# EAGLE design lautnerv (EAGLE 6.2)

## Sheet 1 of 2
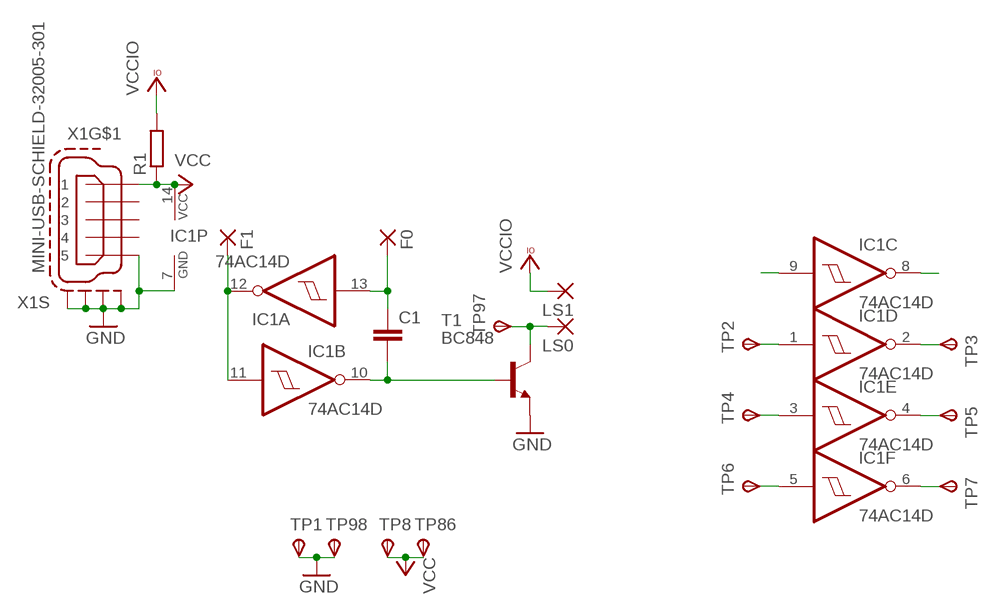
[diagram p0: schematic, sheet 1]

### Parts
C1  C-EUC1206K  [C1206K]
F0  SMD5  [SMD2,54-5,08]
F1  SMD5  [SMD2,54-5,08]
IC1  74AC14D  [SO14]
LS0  SMD5  [SMD2,54-5,08]
LS1  SMD5  [SMD2,54-5,08]
R1  R-EU_M1206  [M1206]
T1  BC848  BC848ASMD  [SOT23]
TP1  TPSTP12SQ  [TP12SQ]
TP2  TPSTP12SQ  [TP12SQ]
TP3  TPSTP12SQ  [TP12SQ]
TP4  TPSTP12SQ  [TP12SQ]
TP5  TPSTP12SQ  [TP12SQ]
TP6  TPSTP12SQ  [TP12SQ]
TP7  TPSTP12SQ  [TP12SQ]
TP8  TPSTP12SQ  [TP12SQ]
TP86  TPSTP12SQ  [TP12SQ]
TP97  TPSTP12SQ  [TP12SQ]
TP98  TPSTP12SQ  [TP12SQ]
X1  MINI-USB-SCHIELD-32005-301  [32005-301]

### Nets
F0: F1.1(P) IC1.11(B:I) IC1.12(A:O)
F1: C1.1 F0.1(P) IC1.13(A:I)
GND: IC1.7(P:GND) T1.2(E) TP1.TP(PP) TP98.TP(PP) X1.5 X1.M1(S:S1) X1.M2(S:S2) X1.M3(S:S3) X1.M4(S:S4)
N$1: LS0.1(P) T1.3(C) TP97.TP(PP)
N$3: IC1.8(C:O)
N$4: C1.2 IC1.10(B:O) T1.1(B)
N$5: IC1.2(D:O) TP3.TP(PP)
N$6: IC1.4(E:O) TP5.TP(PP)
N$7: IC1.6(F:O) TP7.TP(PP)
N$9: IC1.9(C:I)
N$10: IC1.1(D:I) TP2.TP(PP)
N$11: IC1.3(E:I) TP4.TP(PP)
N$12: IC1.5(F:I) TP6.TP(PP)
VCC: IC1.14(P:VCC) R1.1 TP8.TP(PP) TP86.TP(PP) X1.1
VCCIO: LS1.1(P) R1.2
Unconnected: X1.2 X1.3 X1.4

## Sheet 2 of 2
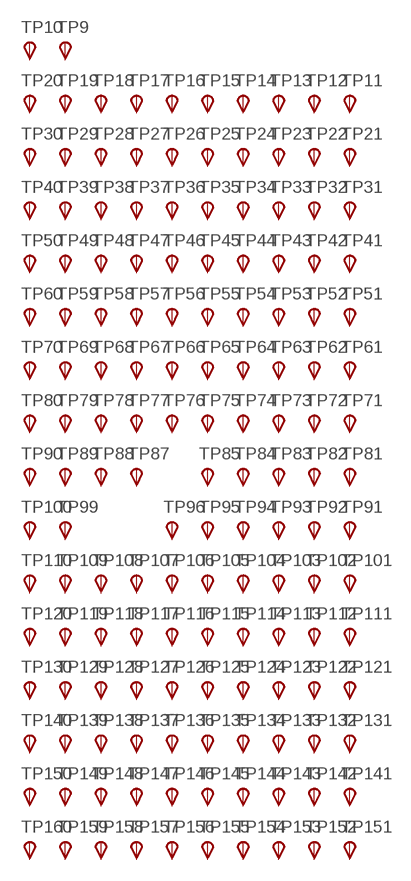
[diagram p1: schematic, sheet 2]

### Parts
TP9  TPSTP12SQ  [TP12SQ]
TP10  TPSTP12SQ  [TP12SQ]
TP11  TPSTP12SQ  [TP12SQ]
TP12  TPSTP12SQ  [TP12SQ]
TP13  TPSTP12SQ  [TP12SQ]
TP14  TPSTP12SQ  [TP12SQ]
TP15  TPSTP12SQ  [TP12SQ]
TP16  TPSTP12SQ  [TP12SQ]
TP17  TPSTP12SQ  [TP12SQ]
TP18  TPSTP12SQ  [TP12SQ]
TP19  TPSTP12SQ  [TP12SQ]
TP20  TPSTP12SQ  [TP12SQ]
TP21  TPSTP12SQ  [TP12SQ]
TP22  TPSTP12SQ  [TP12SQ]
TP23  TPSTP12SQ  [TP12SQ]
TP24  TPSTP12SQ  [TP12SQ]
TP25  TPSTP12SQ  [TP12SQ]
TP26  TPSTP12SQ  [TP12SQ]
TP27  TPSTP12SQ  [TP12SQ]
TP28  TPSTP12SQ  [TP12SQ]
TP29  TPSTP12SQ  [TP12SQ]
TP30  TPSTP12SQ  [TP12SQ]
TP31  TPSTP12SQ  [TP12SQ]
TP32  TPSTP12SQ  [TP12SQ]
TP33  TPSTP12SQ  [TP12SQ]
TP34  TPSTP12SQ  [TP12SQ]
TP35  TPSTP12SQ  [TP12SQ]
TP36  TPSTP12SQ  [TP12SQ]
TP37  TPSTP12SQ  [TP12SQ]
TP38  TPSTP12SQ  [TP12SQ]
TP39  TPSTP12SQ  [TP12SQ]
TP40  TPSTP12SQ  [TP12SQ]
TP41  TPSTP12SQ  [TP12SQ]
TP42  TPSTP12SQ  [TP12SQ]
TP43  TPSTP12SQ  [TP12SQ]
TP44  TPSTP12SQ  [TP12SQ]
TP45  TPSTP12SQ  [TP12SQ]
TP46  TPSTP12SQ  [TP12SQ]
TP47  TPSTP12SQ  [TP12SQ]
TP48  TPSTP12SQ  [TP12SQ]
TP49  TPSTP12SQ  [TP12SQ]
TP50  TPSTP12SQ  [TP12SQ]
TP51  TPSTP12SQ  [TP12SQ]
TP52  TPSTP12SQ  [TP12SQ]
TP53  TPSTP12SQ  [TP12SQ]
TP54  TPSTP12SQ  [TP12SQ]
TP55  TPSTP12SQ  [TP12SQ]
TP56  TPSTP12SQ  [TP12SQ]
TP57  TPSTP12SQ  [TP12SQ]
TP58  TPSTP12SQ  [TP12SQ]
TP59  TPSTP12SQ  [TP12SQ]
TP60  TPSTP12SQ  [TP12SQ]
TP61  TPSTP12SQ  [TP12SQ]
TP62  TPSTP12SQ  [TP12SQ]
TP63  TPSTP12SQ  [TP12SQ]
TP64  TPSTP12SQ  [TP12SQ]
TP65  TPSTP12SQ  [TP12SQ]
TP66  TPSTP12SQ  [TP12SQ]
TP67  TPSTP12SQ  [TP12SQ]
TP68  TPSTP12SQ  [TP12SQ]
TP69  TPSTP12SQ  [TP12SQ]
TP70  TPSTP12SQ  [TP12SQ]
TP71  TPSTP12SQ  [TP12SQ]
TP72  TPSTP12SQ  [TP12SQ]
TP73  TPSTP12SQ  [TP12SQ]
TP74  TPSTP12SQ  [TP12SQ]
TP75  TPSTP12SQ  [TP12SQ]
TP76  TPSTP12SQ  [TP12SQ]
TP77  TPSTP12SQ  [TP12SQ]
TP78  TPSTP12SQ  [TP12SQ]
TP79  TPSTP12SQ  [TP12SQ]
TP80  TPSTP12SQ  [TP12SQ]
TP81  TPSTP12SQ  [TP12SQ]
TP82  TPSTP12SQ  [TP12SQ]
TP83  TPSTP12SQ  [TP12SQ]
TP84  TPSTP12SQ  [TP12SQ]
TP85  TPSTP12SQ  [TP12SQ]
TP87  TPSTP12SQ  [TP12SQ]
TP88  TPSTP12SQ  [TP12SQ]
TP89  TPSTP12SQ  [TP12SQ]
TP90  TPSTP12SQ  [TP12SQ]
TP91  TPSTP12SQ  [TP12SQ]
TP92  TPSTP12SQ  [TP12SQ]
TP93  TPSTP12SQ  [TP12SQ]
TP94  TPSTP12SQ  [TP12SQ]
TP95  TPSTP12SQ  [TP12SQ]
TP96  TPSTP12SQ  [TP12SQ]
TP99  TPSTP12SQ  [TP12SQ]
TP100  TPSTP12SQ  [TP12SQ]
TP101  TPSTP12SQ  [TP12SQ]
TP102  TPSTP12SQ  [TP12SQ]
TP103  TPSTP12SQ  [TP12SQ]
TP104  TPSTP12SQ  [TP12SQ]
TP105  TPSTP12SQ  [TP12SQ]
TP106  TPSTP12SQ  [TP12SQ]
TP107  TPSTP12SQ  [TP12SQ]
TP108  TPSTP12SQ  [TP12SQ]
TP109  TPSTP12SQ  [TP12SQ]
TP110  TPSTP12SQ  [TP12SQ]
TP111  TPSTP12SQ  [TP12SQ]
TP112  TPSTP12SQ  [TP12SQ]
TP113  TPSTP12SQ  [TP12SQ]
TP114  TPSTP12SQ  [TP12SQ]
TP115  TPSTP12SQ  [TP12SQ]
TP116  TPSTP12SQ  [TP12SQ]
TP117  TPSTP12SQ  [TP12SQ]
TP118  TPSTP12SQ  [TP12SQ]
TP119  TPSTP12SQ  [TP12SQ]
TP120  TPSTP12SQ  [TP12SQ]
TP121  TPSTP12SQ  [TP12SQ]
TP122  TPSTP12SQ  [TP12SQ]
TP123  TPSTP12SQ  [TP12SQ]
TP124  TPSTP12SQ  [TP12SQ]
TP125  TPSTP12SQ  [TP12SQ]
TP126  TPSTP12SQ  [TP12SQ]
TP127  TPSTP12SQ  [TP12SQ]
TP128  TPSTP12SQ  [TP12SQ]
TP129  TPSTP12SQ  [TP12SQ]
TP130  TPSTP12SQ  [TP12SQ]
TP131  TPSTP12SQ  [TP12SQ]
TP132  TPSTP12SQ  [TP12SQ]
TP133  TPSTP12SQ  [TP12SQ]
TP134  TPSTP12SQ  [TP12SQ]
TP135  TPSTP12SQ  [TP12SQ]
TP136  TPSTP12SQ  [TP12SQ]
TP137  TPSTP12SQ  [TP12SQ]
TP138  TPSTP12SQ  [TP12SQ]
TP139  TPSTP12SQ  [TP12SQ]
TP140  TPSTP12SQ  [TP12SQ]
TP141  TPSTP12SQ  [TP12SQ]
TP142  TPSTP12SQ  [TP12SQ]
TP143  TPSTP12SQ  [TP12SQ]
TP144  TPSTP12SQ  [TP12SQ]
TP145  TPSTP12SQ  [TP12SQ]
TP146  TPSTP12SQ  [TP12SQ]
TP147  TPSTP12SQ  [TP12SQ]
TP148  TPSTP12SQ  [TP12SQ]
TP149  TPSTP12SQ  [TP12SQ]
TP150  TPSTP12SQ  [TP12SQ]
TP151  TPSTP12SQ  [TP12SQ]
TP152  TPSTP12SQ  [TP12SQ]
TP153  TPSTP12SQ  [TP12SQ]
TP154  TPSTP12SQ  [TP12SQ]
TP155  TPSTP12SQ  [TP12SQ]
TP156  TPSTP12SQ  [TP12SQ]
TP157  TPSTP12SQ  [TP12SQ]
TP158  TPSTP12SQ  [TP12SQ]
TP159  TPSTP12SQ  [TP12SQ]
TP160  TPSTP12SQ  [TP12SQ]
Unconnected: TP9.TP(PP) TP10.TP(PP) TP11.TP(PP) TP12.TP(PP) TP13.TP(PP) TP14.TP(PP) TP15.TP(PP) TP16.TP(PP) TP17.TP(PP) TP18.TP(PP) TP19.TP(PP) TP20.TP(PP) TP21.TP(PP) TP22.TP(PP) TP23.TP(PP) TP24.TP(PP) TP25.TP(PP) TP26.TP(PP) TP27.TP(PP) TP28.TP(PP) TP29.TP(PP) TP30.TP(PP) TP31.TP(PP) TP32.TP(PP) TP33.TP(PP) TP34.TP(PP) TP35.TP(PP) TP36.TP(PP) TP37.TP(PP) TP38.TP(PP) TP39.TP(PP) TP40.TP(PP) TP41.TP(PP) TP42.TP(PP) TP43.TP(PP) TP44.TP(PP) TP45.TP(PP) TP46.TP(PP) TP47.TP(PP) TP48.TP(PP) TP49.TP(PP) TP50.TP(PP) TP51.TP(PP) TP52.TP(PP) TP53.TP(PP) TP54.TP(PP) TP55.TP(PP) TP56.TP(PP) TP57.TP(PP) TP58.TP(PP) TP59.TP(PP) TP60.TP(PP) TP61.TP(PP) TP62.TP(PP) TP63.TP(PP) TP64.TP(PP) TP65.TP(PP) TP66.TP(PP) TP67.TP(PP) TP68.TP(PP) TP69.TP(PP) TP70.TP(PP) TP71.TP(PP) TP72.TP(PP) TP73.TP(PP) TP74.TP(PP) TP75.TP(PP) TP76.TP(PP) TP77.TP(PP) TP78.TP(PP) TP79.TP(PP) TP80.TP(PP) TP81.TP(PP) TP82.TP(PP) TP83.TP(PP) TP84.TP(PP) TP85.TP(PP) TP87.TP(PP) TP88.TP(PP) TP89.TP(PP) TP90.TP(PP) TP91.TP(PP) TP92.TP(PP) TP93.TP(PP) TP94.TP(PP) TP95.TP(PP) TP96.TP(PP) TP99.TP(PP) TP100.TP(PP) TP101.TP(PP) TP102.TP(PP) TP103.TP(PP) TP104.TP(PP) TP105.TP(PP) TP106.TP(PP) TP107.TP(PP) TP108.TP(PP) TP109.TP(PP) TP110.TP(PP) TP111.TP(PP) TP112.TP(PP) TP113.TP(PP) TP114.TP(PP) TP115.TP(PP) TP116.TP(PP) TP117.TP(PP) TP118.TP(PP) TP119.TP(PP) TP120.TP(PP) TP121.TP(PP) TP122.TP(PP) TP123.TP(PP) TP124.TP(PP) TP125.TP(PP) TP126.TP(PP) TP127.TP(PP) TP128.TP(PP) TP129.TP(PP) TP130.TP(PP) TP131.TP(PP) TP132.TP(PP) TP133.TP(PP) TP134.TP(PP) TP135.TP(PP) TP136.TP(PP) TP137.TP(PP) TP138.TP(PP) TP139.TP(PP) TP140.TP(PP) TP141.TP(PP) TP142.TP(PP) TP143.TP(PP) TP144.TP(PP) TP145.TP(PP) TP146.TP(PP) TP147.TP(PP) TP148.TP(PP) TP149.TP(PP) TP150.TP(PP) TP151.TP(PP) TP152.TP(PP) TP153.TP(PP) TP154.TP(PP) TP155.TP(PP) TP156.TP(PP) TP157.TP(PP) TP158.TP(PP) TP159.TP(PP) TP160.TP(PP)

## Library data of the parts
C1 = rcl:C-EU: CAPACITOR, European symbol
F0 F1 LS0 LS1 = wirepad:SMD5: SMD PAD
IC1 = 74xx-eu:74*14: Hex schmitt trigger INVERTER
R1 = rcl:R-EU_: RESISTOR, European symbol
T1 = transistor-npn:BC848*: NPN Transistor
TP1-TP160 = testpad:TPS: TEST PIN
X1 = con-cypressindustries:MINI-USB-SCHIELD-: MINI USB-B Conector Source: www.cypressindustries.com; OC_FARNELL: unknown; OC_NEWARK: unknown

## Board
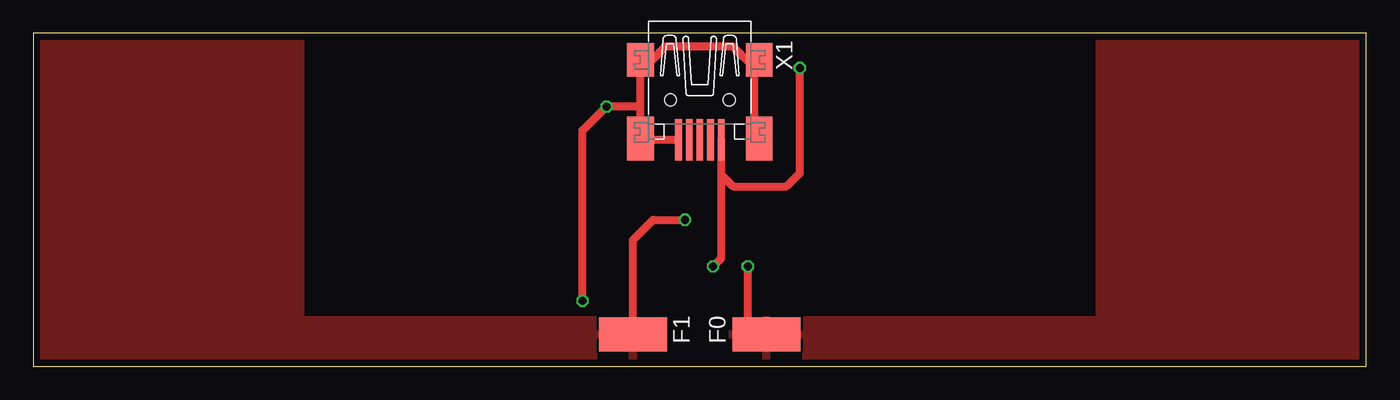
[diagram p2: board, top side]
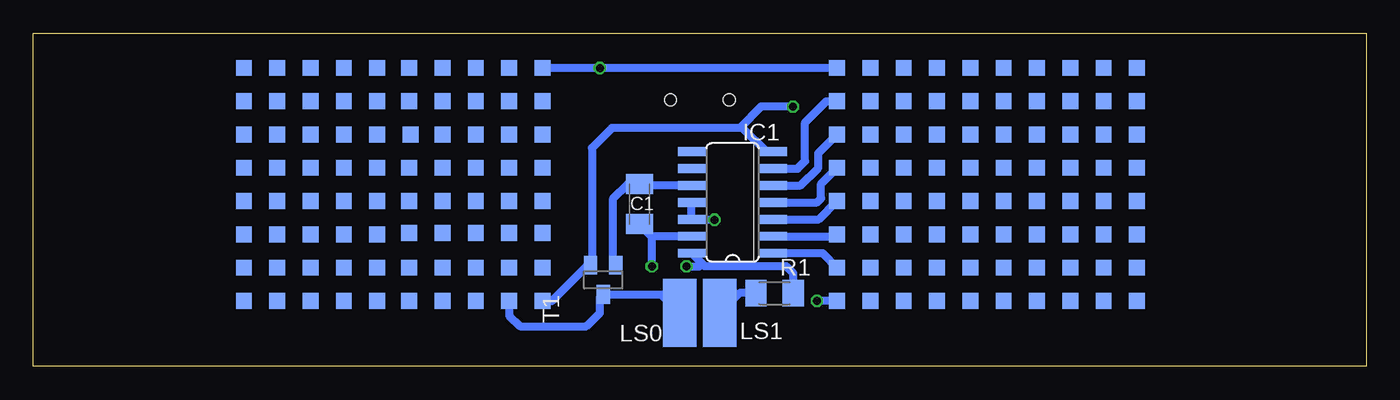
[diagram p3: board, bottom side, seen from below]

Size 100 x 25 mm. Coordinates in mm from the lower left corner, seen from the top.
Outline: 0,0 100,0 100,25 0,25 0,0
Copper layers (1*16): Top 0.035mm / dielectric 1.5mm / Bottom 0.035mm
Design rules: minimum track width 6mil, minimum drill 12mil, track to track 6mil, track to pad 6mil, pad to pad 6mil, via to via 6mil, smd to smd 6mil, copper to edge 20mil, drill to drill 8mil, minimum pad ring 8mil, minimum via ring 6mil, stop-mask expansion 3mil, vias tented up to drill 0mil, thermal gap 8mil

### Footprints (pad centres in the part's own frame; a part is rotated, then mirrored left to right if it is on the bottom)
C1206K = smd 1.5 x 2: 1 -1.5,0; 2 1.5,0
SMD2,54-5,08 = smd 2.54 x 5.08: 1 0,0
SO14 = smd 0.66 x 2.032: 1 -3.81,-3.073; 2 -2.54,-3.073; 3 -1.27,-3.073; 4 0,-3.073; 5 1.27,-3.073; 6 2.54,-3.073; 7 3.81,-3.073; 8 3.81,3.073; 9 2.54,3.073; 10 1.27,3.073; 11 0,3.073; 12 -1.27,3.073; 13 -2.54,3.073; 14 -3.81,3.073
M1206 = smd 1.6 x 2: 1 -1.4,0; 2 1.4,0
SOT23 = smd 1 x 1.4: 1 -0.95,-1.1; 2 0.95,-1.1; 3 0,1.1
TP12SQ = smd 1.2 x 1.2: TP 0,0
32005-301 = smd 3.1 x 0.5: 1 3,1.6; 2 3,0.8; 3 3,0; 4 3,-0.8; 5 3,-1.6 | smd 2.5 x 2: M1 -3,-4.45; M2 -3,4.45 | smd 3.3 x 2: M3 2.9,4.45; M4 2.9,-4.45 | hole 0.9: 0,2.2; 0,-2.2

### Placement (x,y rotation side)
C1  54.52,12.16 90 bottom
F0  55,2.4 270 top
F1  45,2.4 270 top
IC1  47.53,12.3 90 bottom
LS0  51.5,4 180 bottom
LS1  48.5,4 0 bottom
R1  44.38,5.49 180 bottom
T1  57.25,6.49 180 bottom
TP1  39.7,4.9 0 bottom
TP2  39.7,7.4 0 bottom
TP3  39.7,9.9 0 bottom
TP4  39.7,12.4 0 bottom
TP5  39.7,14.9 0 bottom
TP6  39.7,17.4 0 bottom
TP7  39.7,19.9 0 bottom
TP8  39.7,22.4 0 bottom
TP9  37.2,4.9 0 bottom
TP10  37.2,7.4 0 bottom
TP11  37.2,9.9 0 bottom
TP12  37.2,12.4 0 bottom
TP13  37.2,14.9 0 bottom
TP14  37.2,17.4 0 bottom
TP15  37.2,19.9 0 bottom
TP16  37.2,22.4 0 bottom
TP17  34.7,4.9 0 bottom
TP18  34.7,7.4 0 bottom
TP19  34.7,9.9 0 bottom
TP20  34.7,12.4 0 bottom
TP21  34.7,14.9 0 bottom
TP22  34.7,17.4 0 bottom
TP23  34.7,19.9 0 bottom
TP24  34.7,22.4 0 bottom
TP25  32.2,4.9 0 bottom
TP26  32.2,7.4 0 bottom
TP27  32.2,9.9 0 bottom
TP28  32.2,12.4 0 bottom
TP29  32.2,14.9 0 bottom
TP30  32.2,17.4 0 bottom
TP31  32.2,19.9 0 bottom
TP32  32.2,22.4 0 bottom
TP33  29.7,4.9 0 bottom
TP34  29.7,7.4 0 bottom
TP35  29.7,9.9 0 bottom
TP36  29.7,12.4 0 bottom
TP37  29.7,14.9 0 bottom
TP38  29.7,17.4 0 bottom
TP39  29.7,19.9 0 bottom
TP40  29.7,22.4 0 bottom
TP41  71.8,19.9 0 bottom
TP42  69.3,19.9 0 bottom
TP43  64.3,17.4 0 bottom
TP44  69.3,22.4 0 bottom
TP45  69.3,17.4 0 bottom
TP46  66.8,17.4 0 bottom
TP47  71.7,17.4 0 bottom
TP48  71.8,22.4 0 bottom
TP49  27.2,22.4 0 bottom
TP50  24.7,22.4 0 bottom
TP51  22.2,22.4 0 bottom
TP52  19.7,22.4 0 bottom
TP53  27.2,19.9 0 bottom
TP54  24.7,19.9 0 bottom
TP55  22.2,19.9 0 bottom
TP56  19.7,19.9 0 bottom
TP57  27.2,17.4 0 bottom
TP58  24.7,17.4 0 bottom
TP59  22.2,17.4 0 bottom
TP60  19.7,17.4 0 bottom
TP61  27.2,14.9 0 bottom
TP62  24.7,14.9 0 bottom
TP63  22.2,14.9 0 bottom
TP64  19.7,14.9 0 bottom
TP65  27.2,12.4 0 bottom
TP66  24.7,12.4 0 bottom
TP67  22.2,12.4 0 bottom
TP68  19.7,12.4 0 bottom
TP69  27.2,9.9 0 bottom
TP70  24.7,9.9 0 bottom
TP71  22.2,9.9 0 bottom
TP72  19.7,9.9 0 bottom
TP73  27.2,7.4 0 bottom
TP74  24.7,7.4 0 bottom
TP75  22.2,7.4 0 bottom
TP76  19.7,7.4 0 bottom
TP77  27.2,4.9 0 bottom
TP78  24.7,4.9 0 bottom
TP79  22.2,4.9 0 bottom
TP80  19.7,4.9 0 bottom
TP81  69.3,10 0 bottom
TP82  66.8,10 0 bottom
TP83  64.3,10 0 bottom
TP84  61.8,10 0 bottom
TP85  64.3,19.9 0 bottom
TP86  61.8,22.4 0 bottom
TP87  71.8,7.4 0 bottom
TP88  69.3,7.4 0 bottom
TP89  66.8,7.4 0 bottom
TP90  64.3,7.4 0 bottom
TP91  61.8,7.4 0 bottom
TP92  66.8,22.4 0 bottom
TP93  61.8,17.4 0 bottom
TP94  71.8,4.9 0 bottom
TP95  69.3,4.9 0 bottom
TP96  66.8,4.9 0 bottom
TP97  64.3,4.9 0 bottom
TP98  61.8,4.9 0 bottom
TP99  66.8,19.9 0 bottom
TP100  17.2,22.4 0 bottom
TP101  84.2,22.4 0 bottom
TP102  81.7,22.4 0 bottom
TP103  79.2,22.4 0 bottom
TP104  76.7,22.4 0 bottom
TP105  74.2,22.4 0 bottom
TP106  17.2,19.9 0 bottom
TP107  84.2,19.9 0 bottom
TP108  81.7,19.9 0 bottom
TP109  79.2,19.9 0 bottom
TP110  76.7,19.9 0 bottom
TP111  74.2,19.9 0 bottom
TP112  17.2,17.4 0 bottom
TP113  84.2,17.4 0 bottom
TP114  81.7,17.4 0 bottom
TP115  79.2,17.4 0 bottom
TP116  76.7,17.4 0 bottom
TP117  74.2,17.4 0 bottom
TP118  17.2,14.9 0 bottom
TP119  84.2,14.9 0 bottom
TP120  81.7,14.9 0 bottom
TP121  79.2,14.9 0 bottom
TP122  76.7,14.9 0 bottom
TP123  74.2,14.9 0 bottom
TP124  17.2,12.4 0 bottom
TP125  84.2,12.4 0 bottom
TP126  81.7,12.4 0 bottom
TP127  79.2,12.4 0 bottom
TP128  76.7,12.4 0 bottom
TP129  74.2,12.4 0 bottom
TP130  17.2,9.9 0 bottom
TP131  84.2,9.9 0 bottom
TP132  81.7,9.9 0 bottom
TP133  79.2,9.9 0 bottom
TP134  76.7,9.9 0 bottom
TP135  74.2,9.9 0 bottom
TP136  17.2,7.4 0 bottom
TP137  84.2,7.4 0 bottom
TP138  81.7,7.4 0 bottom
TP139  79.2,7.4 0 bottom
TP140  76.7,7.4 0 bottom
TP141  74.2,7.4 0 bottom
TP142  17.2,4.9 0 bottom
TP143  84.2,4.9 0 bottom
TP144  81.7,4.9 0 bottom
TP145  79.2,4.9 0 bottom
TP146  76.7,4.9 0 bottom
TP147  74.2,4.9 0 bottom
TP148  71.8,14.9 0 bottom
TP149  69.3,14.9 0 bottom
TP150  66.8,14.9 0 bottom
TP151  64.3,14.9 0 bottom
TP152  61.8,14.9 0 bottom
TP153  61.8,19.9 0 bottom
TP154  71.8,12.4 0 bottom
TP155  69.3,12.4 0 bottom
TP156  66.8,12.4 0 bottom
TP157  64.3,12.4 0 bottom
TP158  61.8,12.4 0 bottom
TP159  64.3,22.4 0 bottom
TP160  71.8,10 0 bottom
X1  50,20 270 top

### Tracks (layer width: path | path; a pad name or v marks a point on that pad's centre or on a via)
F0  (via drill 0.6)
  Top 0.61: F1.1 45,9.5 46.5,11 v48.9,11
  Bottom 0.61: v48.9,11 50.57,11 IC1.12 IC1.11
  pour Top: 0.5,0.5 0.5,24.5 20,24.5 20,3.5 47,3.5 47,0.5
F1  (via drill 0.6)
  Top 0.61: F0.1 54.2,2.4 53.6,3 v53.6,7.5
  Bottom 0.61: IC1.13 53.61,9.76 | 53.61,9.76 C1.1 | v53.6,7.5 53.6,9.75 53.61,9.76
  pour Top: 99.5,24.5 99.5,0.5 52.5,0.5 52.5,3.5 80,3.5 80,24.5
GND  (via drill 0.6)
  Top 0.61: 54.45,22.95 54.5,23 X1.M2 55,22.45 54.05,22.45 | 45.55,19.5 X1.M4 45.65,17 X1.5 | 45.55,19.5 X1.M1 46.4,23 47.4,24 52.5,24 54.05,22.45 | 54.05,22.45 54.05,17.5 X1.M3 | v41.2,4.9 41.2,17.7 v43,19.5 45.55,19.5
  Bottom 0.61: IC1.7 45,16.11 46.79,17.9 47,17.9 | 47,17.9 56.6,17.9 58.1,16.4 58.1,7.69 T1.2 58.29,7.5 58.5,7.5 61.1,4.9 TP98.TP | TP1.TP v41.2,4.9 | v43,19.5 45.4,19.5 47,17.9
N$1
  Bottom 0.61: LS0.1 52.89,5.39 T1.3 57.5,5.14 57.5,4 58.5,3 63.5,3 64.3,3.8 TP97.TP
N$4
  Bottom 0.61: IC1.10 54.42,13.57 C1.2 54.55,13.7 55.4,13.7 56.5,12.6 56.5,7.8 T1.1
N$5
  Bottom 0.61: IC1.2 39.84,9.76 TP3.TP
N$6
  Bottom 0.61: IC1.4 41.2,12.3 40.9,12.6 40.9,13.7 TP5.TP
N$7
  Bottom 0.61: IC1.6 42.66,14.84 42.1,15.4 42.1,18.3 40.5,19.9 TP7.TP
N$10
  Bottom 0.61: IC1.1 40.79,8.49 TP2.TP
N$11
  Bottom 0.61: IC1.3 41.07,11.03 TP4.TP
N$12
  Bottom 0.61: IC1.5 42.43,13.57 41.1,14.9 41.1,16 TP6.TP
VCC  (via drill 0.6)
  Top 0.61: v51,7.5 51.6,8.1 X1.1 51.6,14.4 52.5,13.5 56.5,13.5 57.5,14.5 v57.5,22.4
  Bottom 0.61: R1.1 42.98,6.98 43.5,7.5 49.61,7.5 49.81,7.69 | 49.81,7.69 IC1.14 | v51,7.5 50,7.5 49.81,7.69 | TP8.TP v57.5,22.4 TP86.TP
VCCIO
  Bottom 0.61: R1.2 47.01,5.49 LS1.1